# EAGLE design led_board_robot_vs_v2_final (EAGLE 8.0.1)
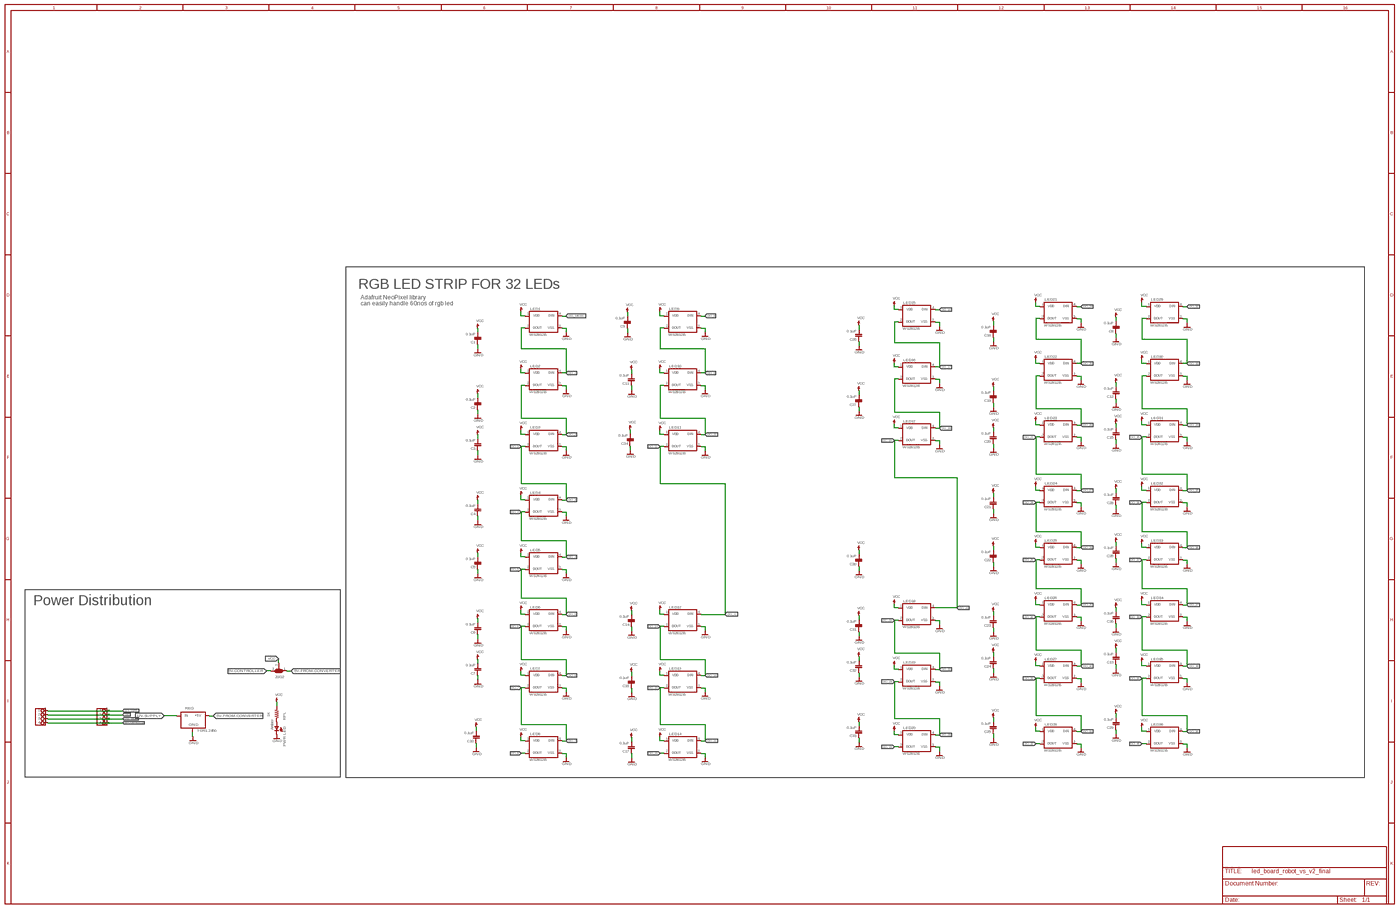
[diagram p0: schematic, sheet 1, overview]
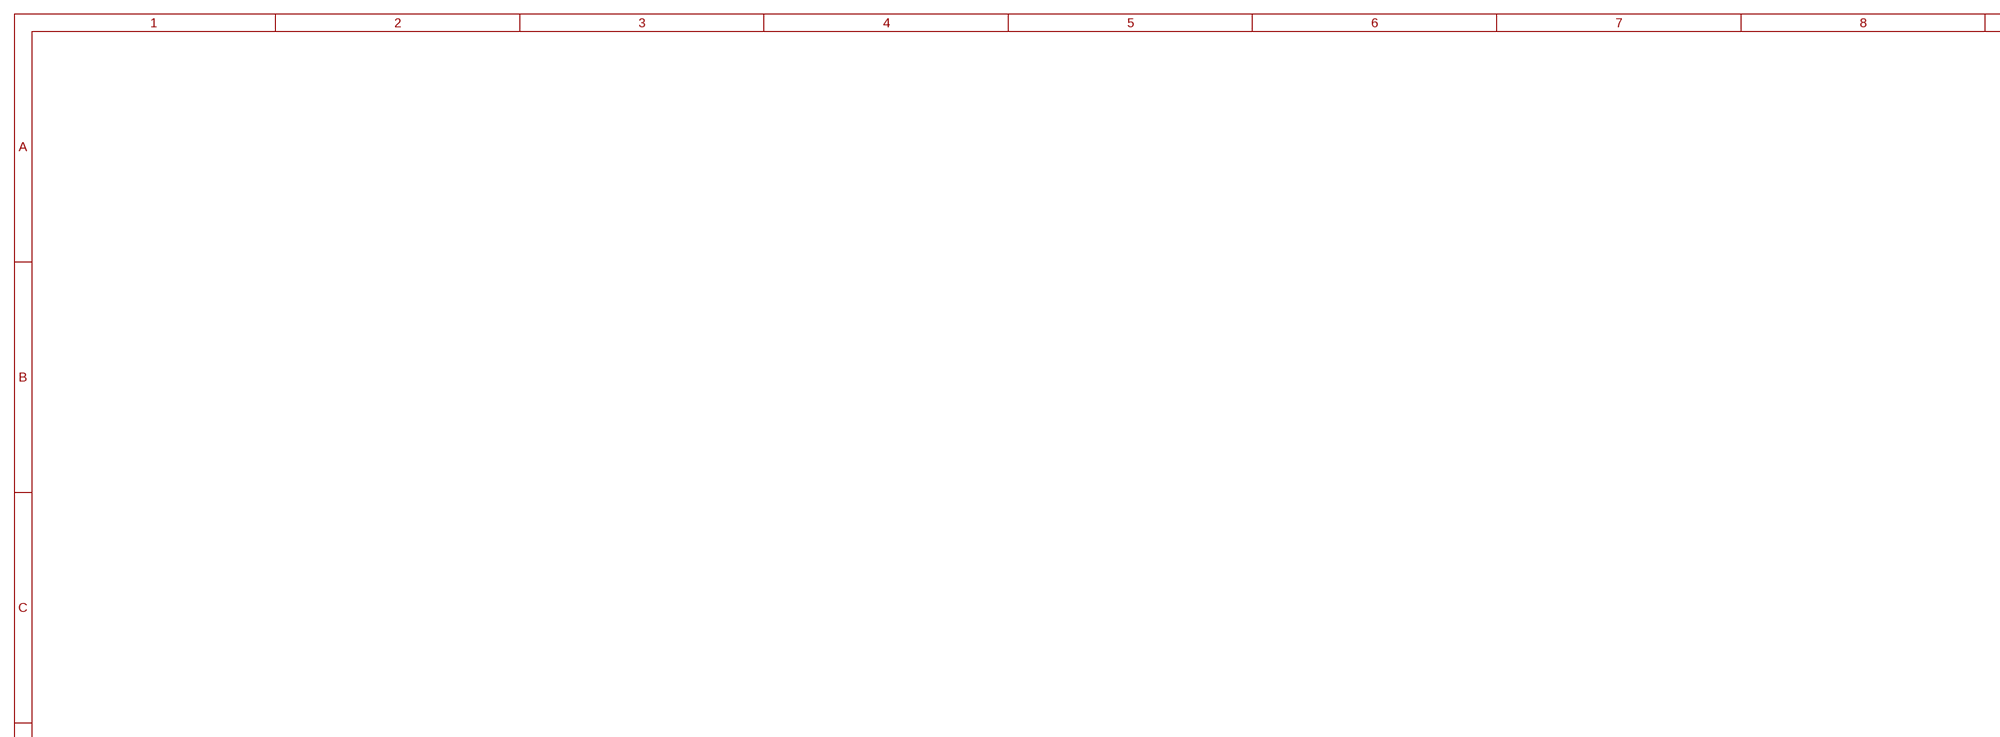
[diagram p1: schematic, sheet 1, part 1 of 4]
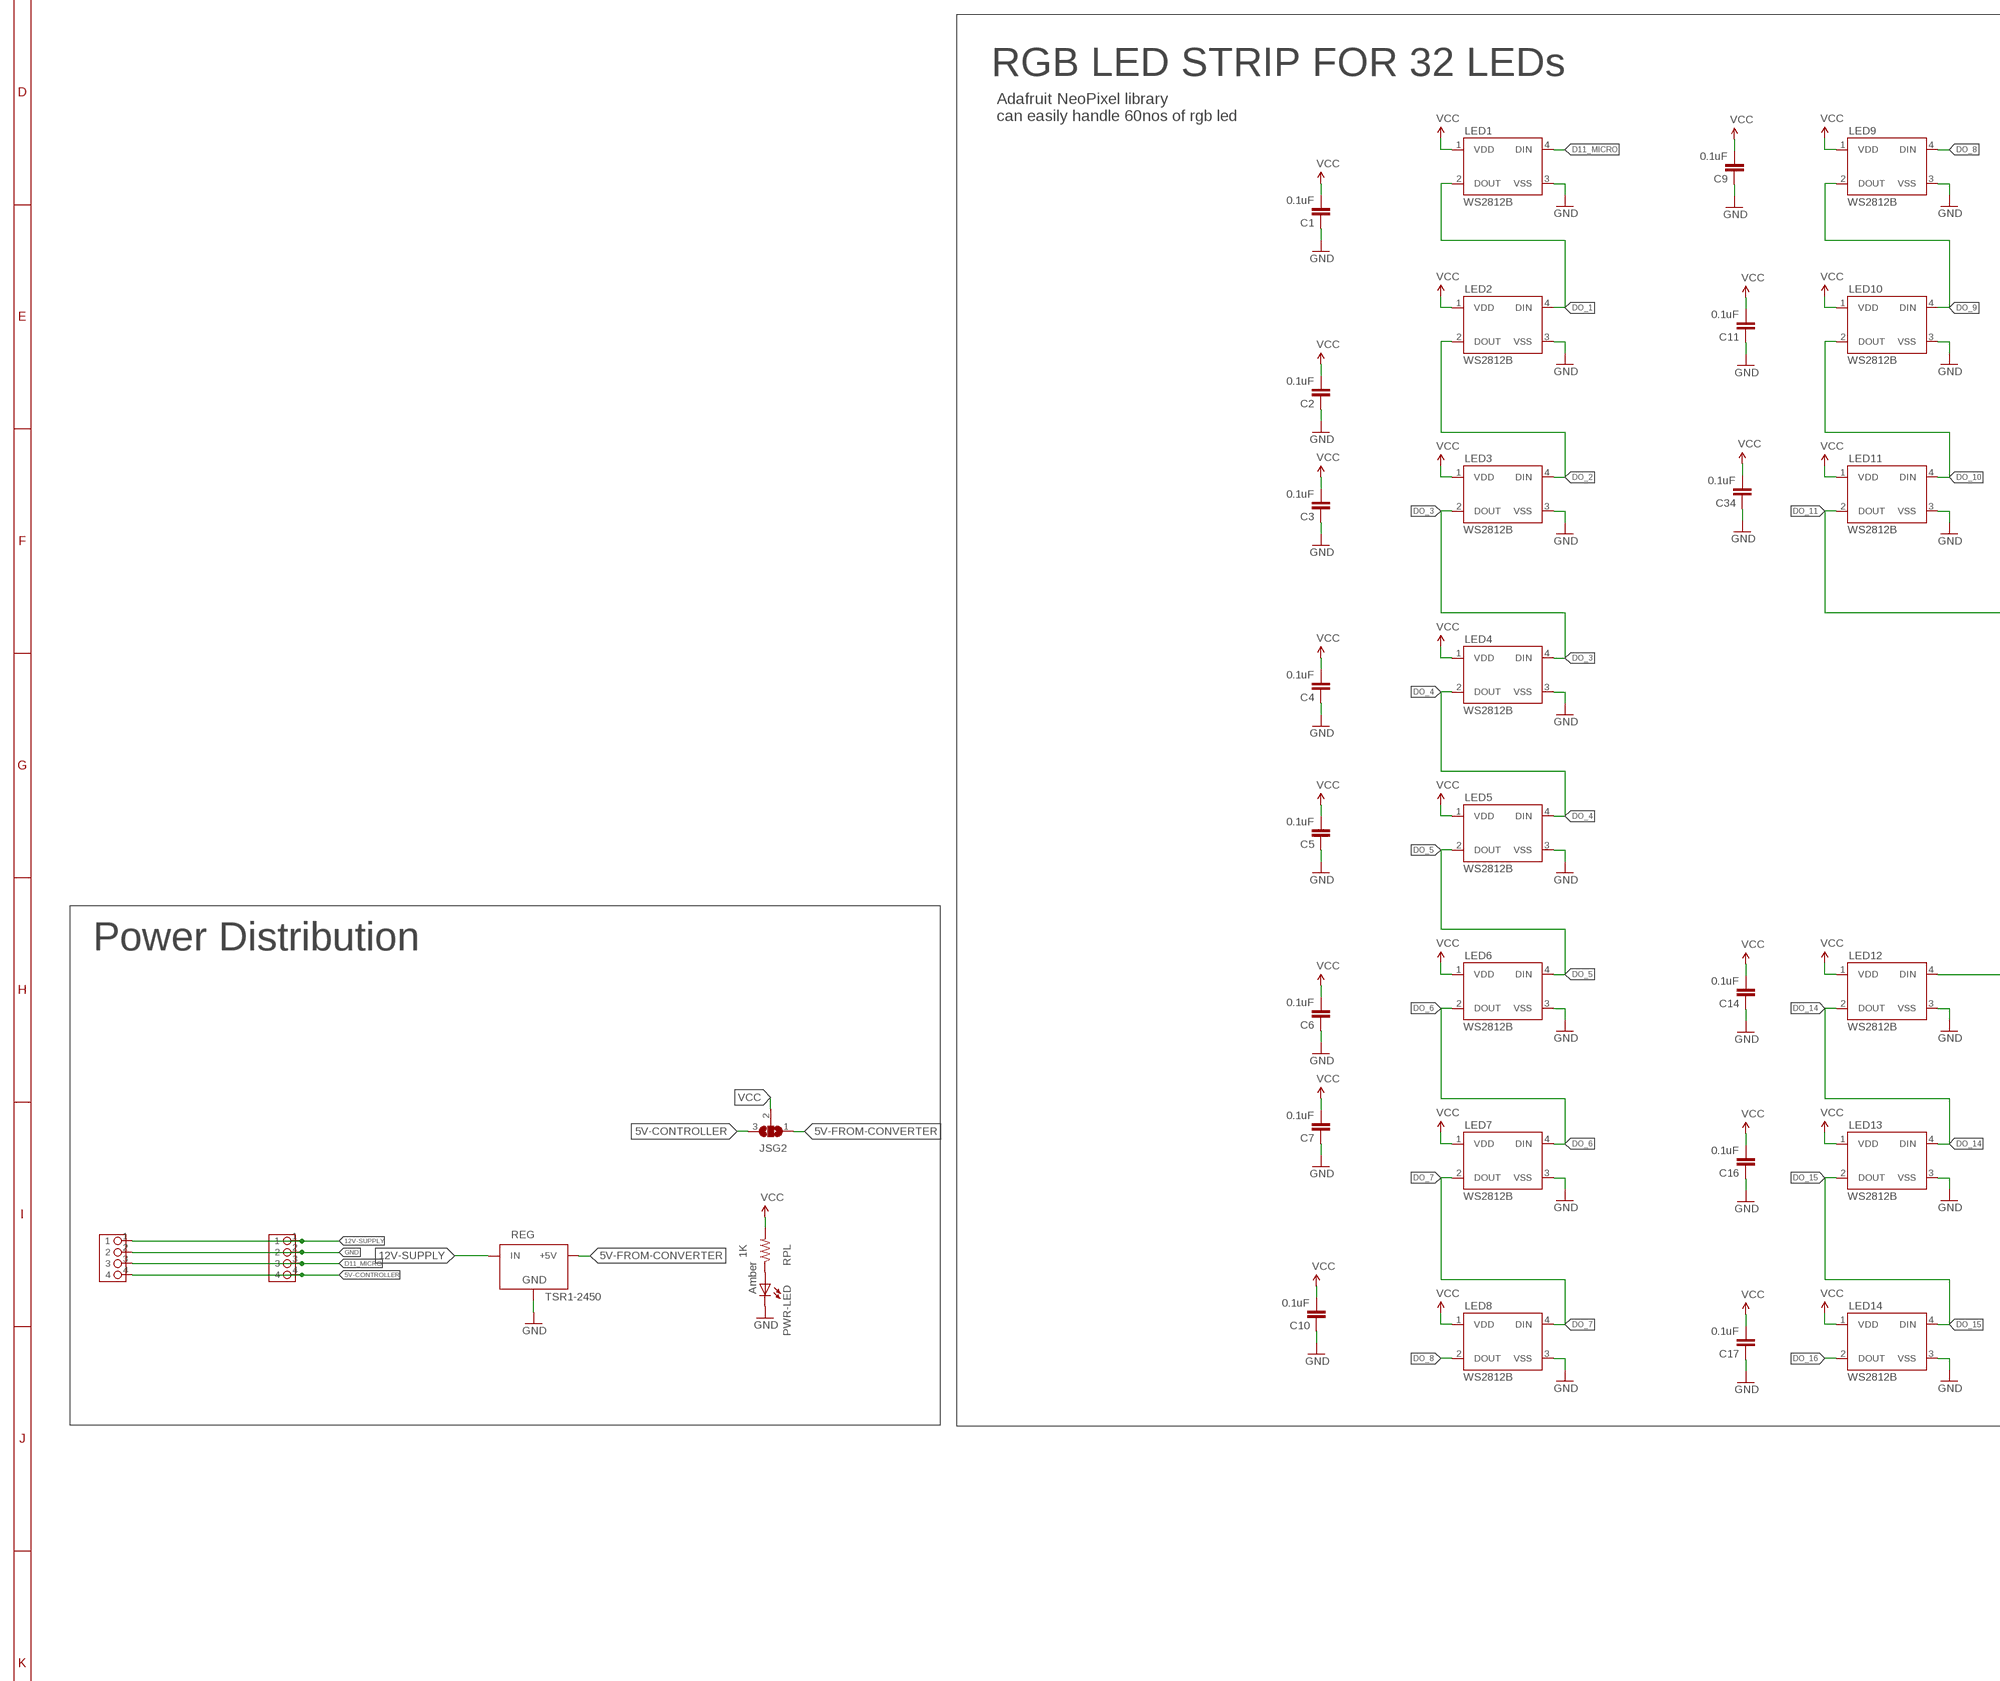
[diagram p2: schematic, sheet 1, part 2 of 4]
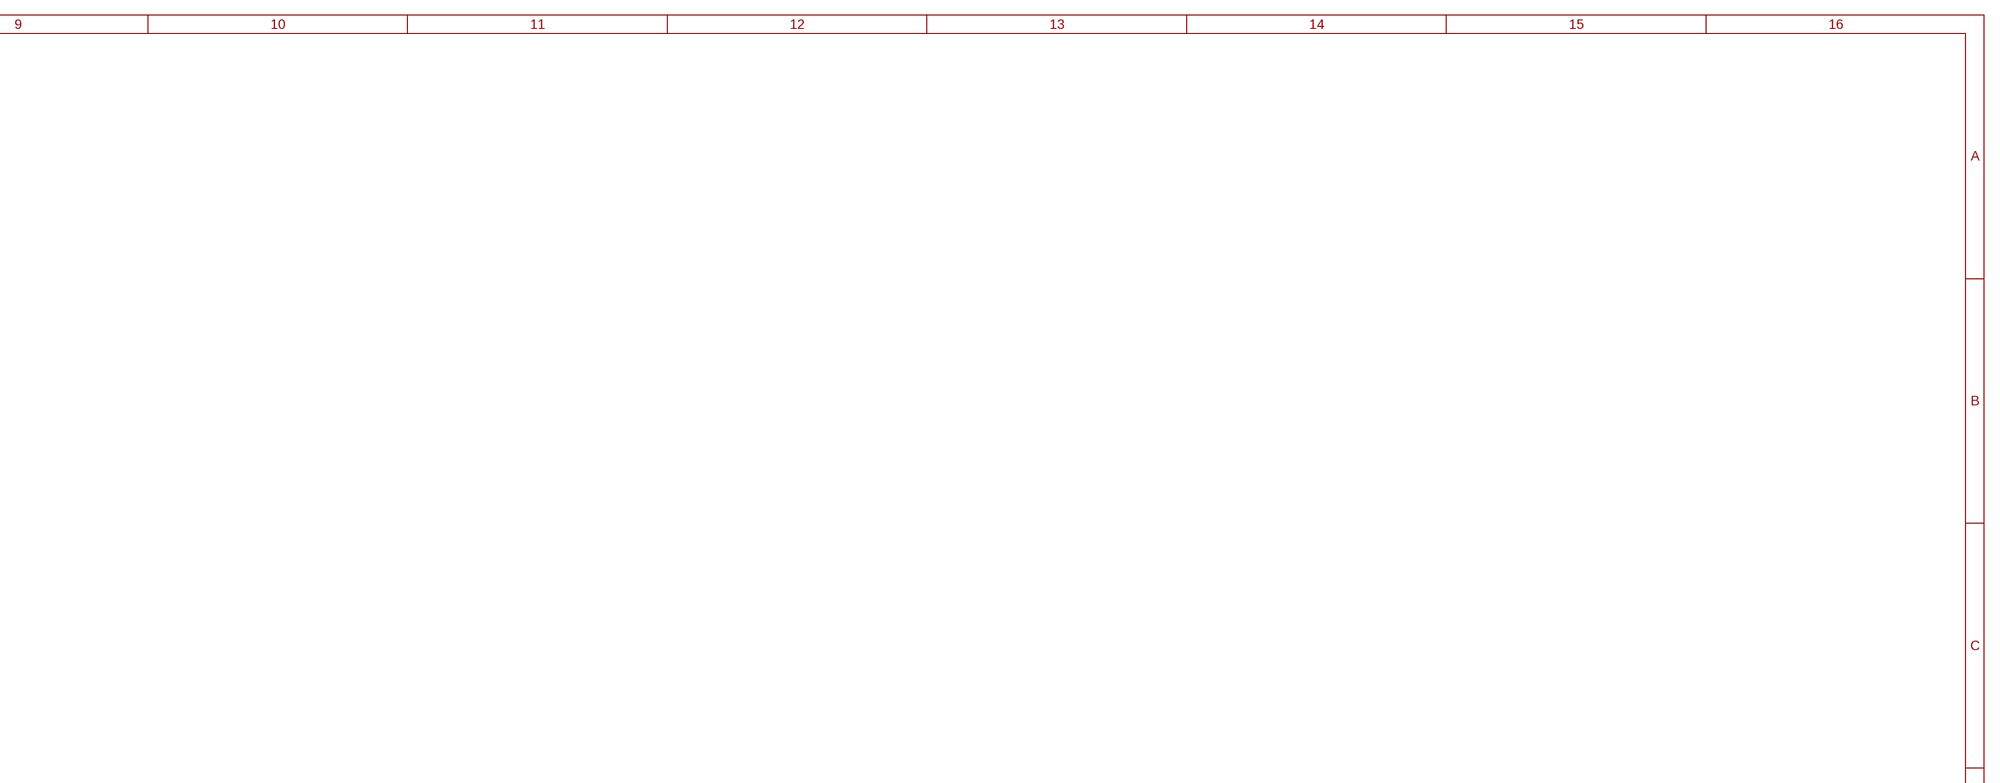
[diagram p3: schematic, sheet 1, part 3 of 4]
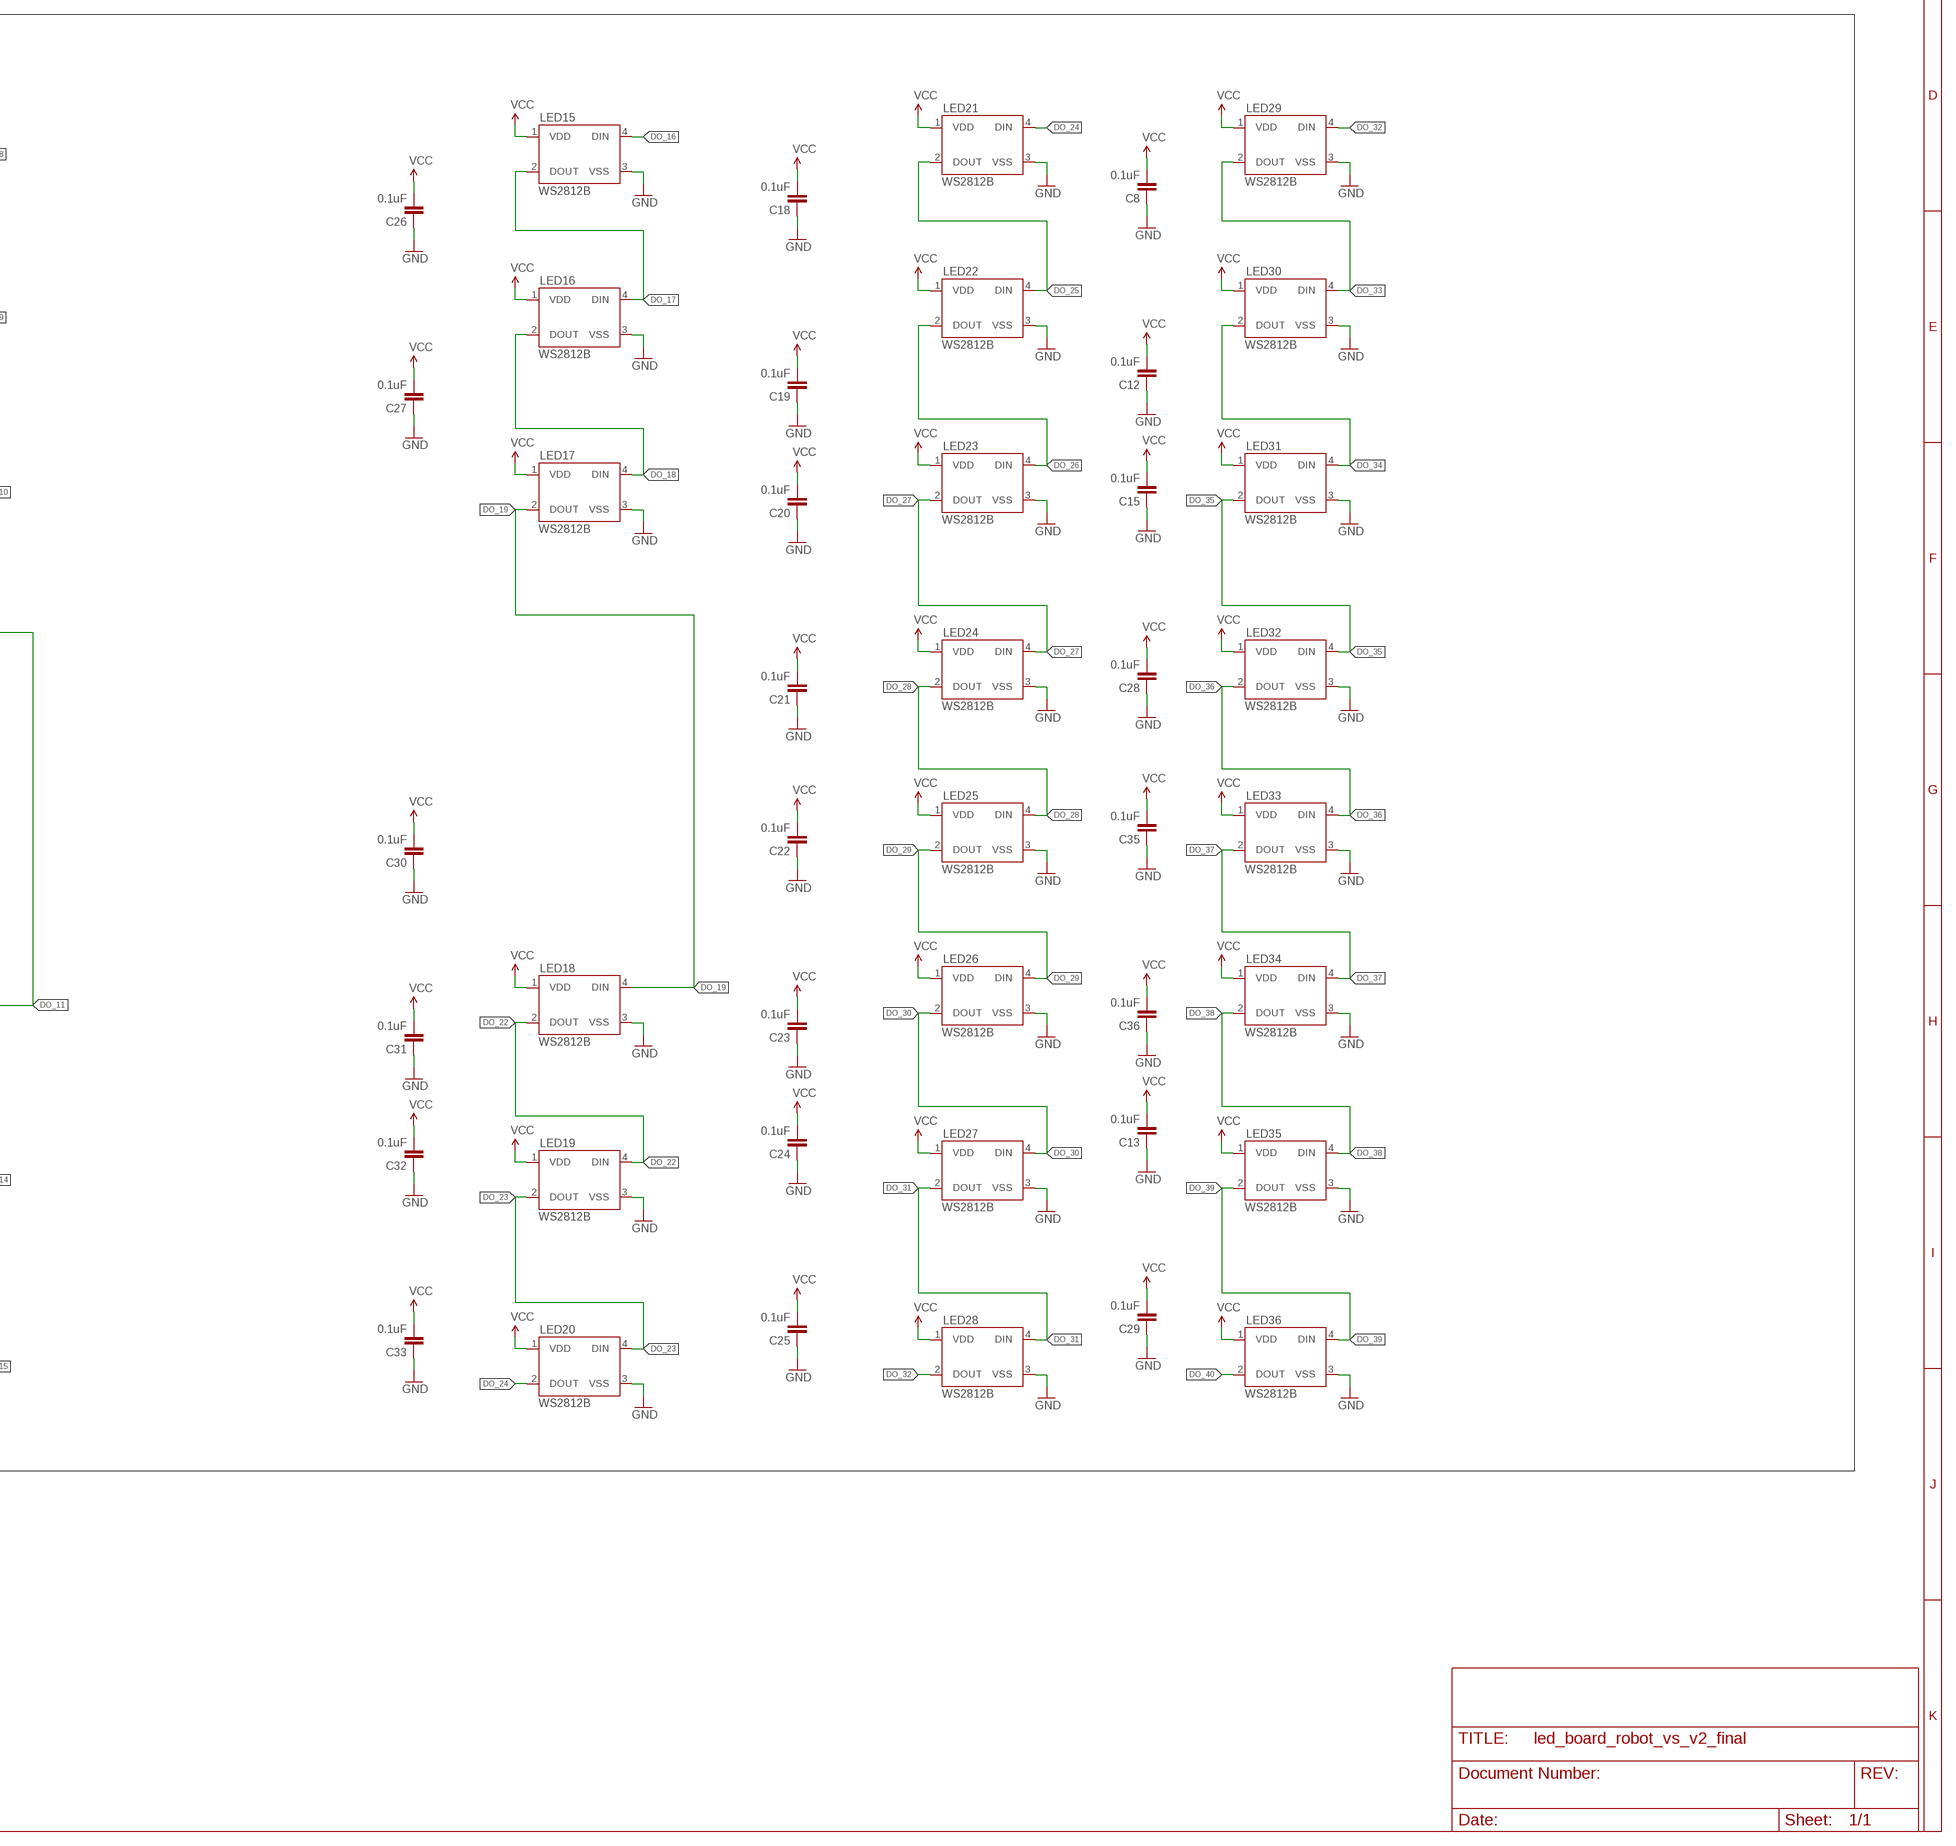
[diagram p4: schematic, sheet 1, part 4 of 4]

## Parts
C1  0.1uF  CAP0603-CAP  [0603-CAP]
C2  0.1uF  CAP0603-CAP  [0603-CAP]
C3  0.1uF  CAP0603-CAP  [0603-CAP]
C4  0.1uF  CAP0603-CAP  [0603-CAP]
C5  0.1uF  CAP0603-CAP  [0603-CAP]
C6  0.1uF  CAP0603-CAP  [0603-CAP]
C7  0.1uF  CAP0603-CAP  [0603-CAP]
C8  0.1uF  CAP0603-CAP  [0603-CAP]
C9  0.1uF  CAP0603-CAP  [0603-CAP]
C10  0.1uF  CAP0603-CAP  [0603-CAP]
C11  0.1uF  CAP0603-CAP  [0603-CAP]
C12  0.1uF  CAP0603-CAP  [0603-CAP]
C13  0.1uF  CAP0603-CAP  [0603-CAP]
C14  0.1uF  CAP0603-CAP  [0603-CAP]
C15  0.1uF  CAP0603-CAP  [0603-CAP]
C16  0.1uF  CAP0603-CAP  [0603-CAP]
C17  0.1uF  CAP0603-CAP  [0603-CAP]
C18  0.1uF  CAP0603-CAP  [0603-CAP]
C19  0.1uF  CAP0603-CAP  [0603-CAP]
C20  0.1uF  CAP0603-CAP  [0603-CAP]
C21  0.1uF  CAP0603-CAP  [0603-CAP]
C22  0.1uF  CAP0603-CAP  [0603-CAP]
C23  0.1uF  CAP0603-CAP  [0603-CAP]
C24  0.1uF  CAP0603-CAP  [0603-CAP]
C25  0.1uF  CAP0603-CAP  [0603-CAP]
C26  0.1uF  CAP0603-CAP  [0603-CAP]
C27  0.1uF  CAP0603-CAP  [0603-CAP]
C28  0.1uF  CAP0603-CAP  [0603-CAP]
C29  0.1uF  CAP0603-CAP  [0603-CAP]
C30  0.1uF  CAP0603-CAP  [0603-CAP]
C31  0.1uF  CAP0603-CAP  [0603-CAP]
C32  0.1uF  CAP0603-CAP  [0603-CAP]
C33  0.1uF  CAP0603-CAP  [0603-CAP]
C34  0.1uF  CAP0603-CAP  [0603-CAP]
C35  0.1uF  CAP0603-CAP  [0603-CAP]
C36  0.1uF  CAP0603-CAP  [0603-CAP]
CON1  MOLEX_LOCKING_4PIN  [MOLEX_LOCKING_4PIN]
CON2  MOLEX_LOCKING_4PIN  [MOLEX_LOCKING_4PIN]
JSG2  SJ2WW  [SJ_2W]
LED1  WS2812B  [WS2812B]
LED2  WS2812B  [WS2812B]
LED3  WS2812B  [WS2812B]
LED4  WS2812B  [WS2812B]
LED5  WS2812B  [WS2812B]
LED6  WS2812B  [WS2812B]
LED7  WS2812B  [WS2812B]
LED8  WS2812B  [WS2812B]
LED9  WS2812B  [WS2812B]
LED10  WS2812B  [WS2812B]
LED11  WS2812B  [WS2812B]
LED12  WS2812B  [WS2812B]
LED13  WS2812B  [WS2812B]
LED14  WS2812B  [WS2812B]
LED15  WS2812B  [WS2812B]
LED16  WS2812B  [WS2812B]
LED17  WS2812B  [WS2812B]
LED18  WS2812B  [WS2812B]
LED19  WS2812B  [WS2812B]
LED20  WS2812B  [WS2812B]
LED21  WS2812B  [WS2812B]
LED22  WS2812B  [WS2812B]
LED23  WS2812B  [WS2812B]
LED24  WS2812B  [WS2812B]
LED25  WS2812B  [WS2812B]
LED26  WS2812B  [WS2812B]
LED27  WS2812B  [WS2812B]
LED28  WS2812B  [WS2812B]
LED29  WS2812B  [WS2812B]
LED30  WS2812B  [WS2812B]
LED31  WS2812B  [WS2812B]
LED32  WS2812B  [WS2812B]
LED33  WS2812B  [WS2812B]
LED34  WS2812B  [WS2812B]
LED35  WS2812B  [WS2812B]
LED36  WS2812B  [WS2812B]
PWR-LED  Amber  LED0603  [LED-0603]
REG  TSR1-2450  [TSR-1]
RPL  1K  RESISTOR0603-RES  [0603-RES]

## Nets
5V-CONTROLLER [power]: CON1.4 CON2.4 JSG2.3
5V-FROM-CONVERTER [power]: JSG2.1 REG.3(+5V)
12V-SUPPLY [power]: CON1.1 CON2.1 REG.1(IN)
D11_MICRO [power]: CON1.3 CON2.3 LED1.4(DIN)
DO_1: LED1.2(DOUT) LED2.4(DIN)
DO_2 [power]: LED2.2(DOUT) LED3.4(DIN)
DO_3 [power]: LED3.2(DOUT) LED4.4(DIN)
DO_4 [power]: LED4.2(DOUT) LED5.4(DIN)
DO_5 [power]: LED5.2(DOUT) LED6.4(DIN)
DO_6 [power]: LED6.2(DOUT) LED7.4(DIN)
DO_7 [power]: LED7.2(DOUT) LED8.4(DIN)
DO_8: LED8.2(DOUT) LED9.4(DIN)
DO_9: LED9.2(DOUT) LED10.4(DIN)
DO_10: LED10.2(DOUT) LED11.4(DIN)
DO_11 [power]: LED11.2(DOUT) LED12.4(DIN)
DO_14 [power]: LED12.2(DOUT) LED13.4(DIN)
DO_15 [power]: LED13.2(DOUT) LED14.4(DIN)
DO_16 [power]: LED14.2(DOUT) LED15.4(DIN)
DO_17 [power]: LED15.2(DOUT) LED16.4(DIN)
DO_18 [power]: LED16.2(DOUT) LED17.4(DIN)
DO_19: LED17.2(DOUT) LED18.4(DIN)
DO_22 [power]: LED18.2(DOUT) LED19.4(DIN)
DO_23 [power]: LED19.2(DOUT) LED20.4(DIN)
DO_24 [power]: LED20.2(DOUT) LED21.4(DIN)
DO_25 [power]: LED21.2(DOUT) LED22.4(DIN)
DO_26 [power]: LED22.2(DOUT) LED23.4(DIN)
DO_27 [power]: LED23.2(DOUT) LED24.4(DIN)
DO_28: LED24.2(DOUT) LED25.4(DIN)
DO_29: LED25.2(DOUT) LED26.4(DIN)
DO_30: LED26.2(DOUT) LED27.4(DIN)
DO_31: LED27.2(DOUT) LED28.4(DIN)
DO_32 [power]: LED28.2(DOUT) LED29.4(DIN)
DO_33 [power]: LED29.2(DOUT) LED30.4(DIN)
DO_34 [power]: LED30.2(DOUT) LED31.4(DIN)
DO_35 [power]: LED31.2(DOUT) LED32.4(DIN)
DO_36: LED32.2(DOUT) LED33.4(DIN)
DO_37: LED33.2(DOUT) LED34.4(DIN)
DO_38: LED34.2(DOUT) LED35.4(DIN)
DO_39: LED35.2(DOUT) LED36.4(DIN)
DO_40 [power]: LED36.2(DOUT)
GND [power]: C1.1 C2.1 C3.1 C4.1 C5.1 C6.1 C7.1 C8.1 C9.1 C10.1 C11.1 C12.1 C13.1 C14.1 C15.1 C16.1 C17.1 C18.1 C19.1 C20.1 C21.1 C22.1 C23.1 C24.1 C25.1 C26.1 C27.1 C28.1 C29.1 C30.1 C31.1 C32.1 C33.1 C34.1 C35.1 C36.1 CON1.2 CON2.2 LED1.3(VSS) LED2.3(VSS) LED3.3(VSS) LED4.3(VSS) LED5.3(VSS) LED6.3(VSS) LED7.3(VSS) LED8.3(VSS) LED9.3(VSS) LED10.3(VSS) LED11.3(VSS) LED12.3(VSS) LED13.3(VSS) LED14.3(VSS) LED15.3(VSS) LED16.3(VSS) LED17.3(VSS) LED18.3(VSS) LED19.3(VSS) LED20.3(VSS) LED21.3(VSS) LED22.3(VSS) LED23.3(VSS) LED24.3(VSS) LED25.3(VSS) LED26.3(VSS) LED27.3(VSS) LED28.3(VSS) LED29.3(VSS) LED30.3(VSS) LED31.3(VSS) LED32.3(VSS) LED33.3(VSS) LED34.3(VSS) LED35.3(VSS) LED36.3(VSS) PWR-LED.C REG.2(GND)
N$17: PWR-LED.A RPL.1
VCC [power]: C1.2 C2.2 C3.2 C4.2 C5.2 C6.2 C7.2 C8.2 C9.2 C10.2 C11.2 C12.2 C13.2 C14.2 C15.2 C16.2 C17.2 C18.2 C19.2 C20.2 C21.2 C22.2 C23.2 C24.2 C25.2 C26.2 C27.2 C28.2 C29.2 C30.2 C31.2 C32.2 C33.2 C34.2 C35.2 C36.2 JSG2.2 LED1.1(VDD) LED2.1(VDD) LED3.1(VDD) LED4.1(VDD) LED5.1(VDD) LED6.1(VDD) LED7.1(VDD) LED8.1(VDD) LED9.1(VDD) LED10.1(VDD) LED11.1(VDD) LED12.1(VDD) LED13.1(VDD) LED14.1(VDD) LED15.1(VDD) LED16.1(VDD) LED17.1(VDD) LED18.1(VDD) LED19.1(VDD) LED20.1(VDD) LED21.1(VDD) LED22.1(VDD) LED23.1(VDD) LED24.1(VDD) LED25.1(VDD) LED26.1(VDD) LED27.1(VDD) LED28.1(VDD) LED29.1(VDD) LED30.1(VDD) LED31.1(VDD) LED32.1(VDD) LED33.1(VDD) LED34.1(VDD) LED35.1(VDD) LED36.1(VDD) RPL.2

## Notes on the sheet
- RGB LED STRIP FOR 32 LEDs
- Adafruit NeoPixel library 
  can easily handle 60nos of rgb led
- Power Distribution

## Library data of the parts
C1-C36 = SparkFun:CAP: Capacitor Standard 0603 ceramic capacitor, and 0.1" leaded capacitor.
CON1 CON2 = molex_connector:MOLEX_LOCKING_4PIN; PARTNO: 43650-0415
JSG2 = jumper:SJ2W: SMD solder JUMPER
LED1-LED36 = SparkFun-LED:WS2812B: WS2812B - Intelligent control LED integrated light source Technical Specifications: Power Supply Voltage (VDD): 3.5 to 5.3 V Input Voltage (VI): -0.5 to VDD+0.5 V Operating Junction Temperature (Topt): -25°C to +80°C Storage Temperature Range (Tstg): -55°C to +150°C; PROD_ID: DIO-12503
PWR-LED = SparkFun:LED: LEDs Standard schematic elements and footprints for 5mm, 3mm, 1206, and 0603 sized LEDs. 5mm - Spark Fun Electronics SKU : COM-00529 (and others)
REG = SteelCaveRobotics-Power:TSR1-2450: Traco Power TSR 1-2450 5.0v switching regulator
RPL = SparkFun:RESISTOR: Resistor Basic schematic elements and footprints for 0603, 1206, and PTH resistors.

## Net classes
0 default: width 0.762 mm, drill 0.762 mm, clearance 0.559 mm
1 power: width 0.762 mm, drill 0.762 mm, clearance 0.381 mm
2 Massa: width 0.8 mm, drill 0.6 mm, clearance 0.2 mm
3 Mot: width 1.2 mm, drill 0.8 mm, clearance 0.005 mm
4 motor: width 0.305 mm, drill 0.406 mm, clearance 0.203 mm

## Board
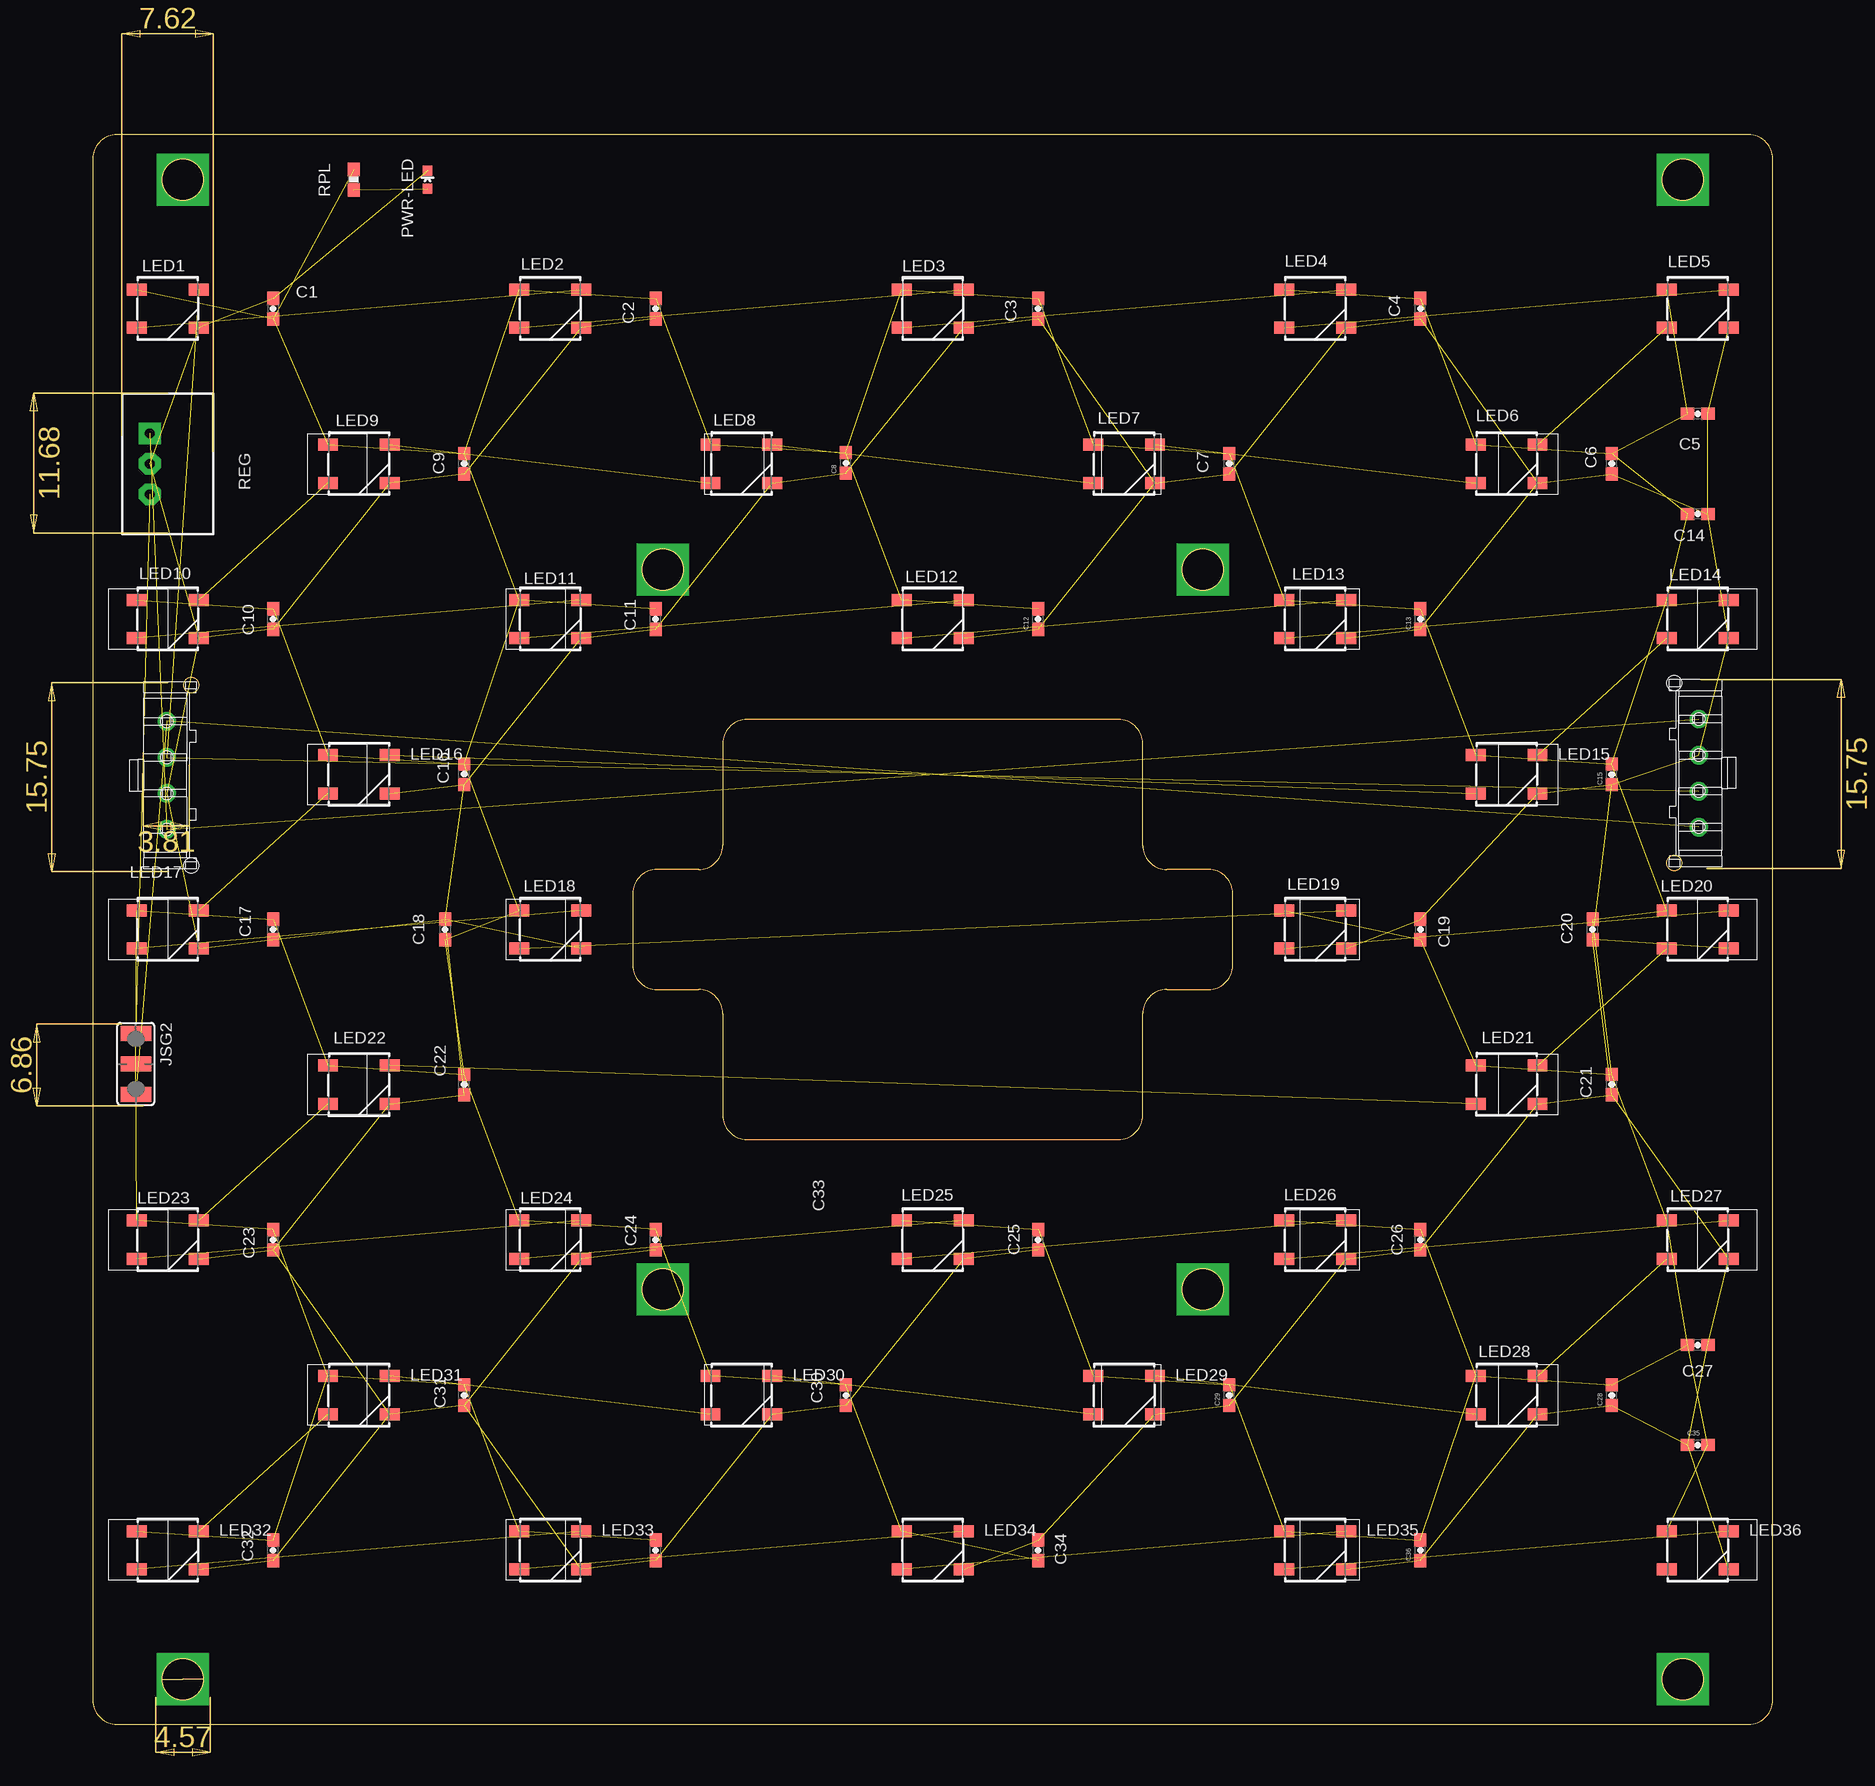
[diagram p5: board, top side]

Size 140 x 132.5 mm. Coordinates in mm from the lower left corner, seen from the top.
Outline: 2,0 138,0 arc90 140,2 140,130.5 arc90 138,132.5 2,132.5 arc90 0,130.5 0,2 arc90 2,0
Outline: 52.5,59.25 52.5,50.75 arc90 54.5,48.75 85.5,48.75 arc90 87.5,50.75 87.5,59.25 arc-90 89.5,61.25 93,61.25 arc90 95,63.25 95,69.25 arc90 93,71.25 89.5,71.25 arc-90 87.5,73.25 87.5,81.75 arc90 85.5,83.75 54.5,83.75 arc90 52.5,81.75 52.5,73.25 arc-90 50.5,71.25 47,71.25 arc90 45,69.25 45,63.25 arc90 47,61.25 50.5,61.25 arc-90 52.5,59.25
Outline: circle at 132.5,128.75 radius 1.7
Outline: circle at 7.5,3.75 radius 1.7
Outline: circle at 7.5,128.75 radius 1.7
Outline: circle at 132.5,3.75 radius 1.7
Outline: circle at 47.5,96.25 radius 1.7
Outline: circle at 47.5,36.25 radius 1.7
Outline: circle at 92.5,96.25 radius 1.7
Outline: circle at 92.5,36.25 radius 1.7
Outline: circle at 47.5,96.25 radius 1.7
Outline: circle at 92.5,36.25 radius 1.7
Outline: circle at 92.5,96.25 radius 1.7
Outline: circle at 47.5,36.25 radius 1.7
Copper layers (1*16): Top 0.035mm / dielectric 1.5mm / Bottom 0.035mm
Design rules "default": minimum track width 10mil, minimum drill 24mil, track to track 8mil, track to pad 8mil, pad to pad 8mil, via to via 8mil, smd to smd 8mil, copper to edge 40mil, drill to drill 8mil, minimum pad ring 10mil, minimum via ring 8mil, stop-mask expansion 4mil, vias tented up to drill 0mil, thermal gap 10mil

### Footprints (pad centres in the part's own frame; a part is rotated, then mirrored left to right if it is on the bottom)
0603-CAP = smd 1.1 x 1: 1 -0.85,0; 2 0.85,0
MOLEX_LOCKING_4PIN = drill 1.02: 1 -4.593,0.08; 2 -1.591,0.08; 3 1.41,0.08; 4 4.412,0.08
SJ_2W = smd 1.27 x 2.54: 1 -2.54,0; 2 0,0; 3 2.54,0
WS2812B = smd 1.651 x 1: 1 -2.577,1.6; 2 -2.577,-1.6; 3 2.577,-1.6; 4 2.577,1.6
LED-0603 = smd 0.8 x 0.8: A 0,-0.75; C 0,0.75
TSR-1 = drill 0.8 pad 1.8 square: 1 -2.54,-1.5 | drill 0.8 pad 1.8 octagon: 2 0,-1.5; 3 2.54,-1.5
0603-RES = smd 1.1 x 1: 1 -0.85,0; 2 0.85,0

### Placement (x,y rotation side)
C1  15.02,118 270 top
C2  46.9,118 90 top
C3  78.77,118 90 top
C4  110.64,118 90 top
C5  133.75,109.23 180 top
C6  126.59,105.07 90 top
C7  94.71,105.07 90 top
C8  62.76,105.14 90 top
C9  30.95,105.07 90 top
C10  15.02,92.12 90 top
C11  46.9,92.12 90 top
C12  78.77,92.12 90 top
C13  110.64,92.12 90 top
C14  133.75,100.89 180 top
C15  126.59,79.18 90 top
C16  30.95,79.19 90 top
C17  15.02,66.25 90 top
C18  29.35,66.25 270 top
C19  110.64,66.25 270 top
C20  124.98,66.25 90 top
C21  126.59,53.32 90 top
C22  30.95,53.32 90 top
C23  15.02,40.38 90 top
C24  46.9,40.38 90 top
C25  78.77,40.38 90 top
C26  110.64,40.38 90 top
C27  133.75,31.61 180 top
C28  126.59,27.43 90 top
C29  94.71,27.43 90 top
C30  62.76,27.43 90 top
C31  30.95,27.43 90 top
C32  15.02,14.5 90 top
C33  46.9,14.5 90 top
C34  78.77,14.5 270 top
C35  133.75,23.27 0 top
C36  110.64,14.5 90 top
CON1  133.75,79.19 270 top
CON2  6.25,79.19 90 top
JSG2  3.58,55.04 270 top
LED1  6.25,118 0 top
LED2  38.12,118 0 top
LED3  70,118 0 top
LED4  101.88,118 0 top
LED5  133.75,118 0 top
LED6  117.82,105.07 0 top
LED7  85.94,105.07 0 top
LED8  54.06,105.07 0 top
LED9  22.18,105.07 0 top
LED10  6.25,92.12 0 top
LED11  38.12,92.12 0 top
LED12  70,92.12 0 top
LED13  101.88,92.12 0 top
LED14  133.75,92.12 0 top
LED15  117.82,79.18 0 top
LED16  22.18,79.19 0 top
LED17  6.25,66.25 0 top
LED18  38.12,66.25 0 top
LED19  101.88,66.25 0 top
LED20  133.75,66.25 0 top
LED21  117.82,53.32 0 top
LED22  22.18,53.31 0 top
LED23  6.25,40.38 0 top
LED24  38.12,40.38 0 top
LED25  70,40.38 0 top
LED26  101.88,40.38 0 top
LED27  133.75,40.38 0 top
LED28  117.82,27.43 0 top
LED29  85.94,27.43 0 top
LED30  54.06,27.43 0 top
LED31  22.18,27.43 0 top
LED32  6.25,14.5 0 top
LED33  38.12,14.5 0 top
LED34  70,14.5 0 top
LED35  101.88,14.5 0 top
LED36  133.75,14.5 0 top
PWR-LED  27.9,128.75 0 top
REG  6.25,105.07 270 top
RPL  21.75,128.75 90 top

### Tracks (layer width: path | path; a pad name or v marks a point on that pad's centre or on a via)
5V-CONTROLLER  (2 unrouted)
5V-FROM-CONVERTER  (1 unrouted)
12V-SUPPLY  (2 unrouted)
D11_MICRO  (2 unrouted)
DO_1  (1 unrouted)
DO_2  (1 unrouted)
DO_3  (1 unrouted)
DO_4  (1 unrouted)
DO_5  (1 unrouted)
DO_6  (1 unrouted)
DO_7  (1 unrouted)
DO_8  (1 unrouted)
DO_9  (1 unrouted)
DO_10  (1 unrouted)
DO_11  (1 unrouted)
DO_14  (1 unrouted)
DO_15  (1 unrouted)
DO_16  (1 unrouted)
DO_17  (1 unrouted)
DO_18  (1 unrouted)
DO_19  (1 unrouted)
DO_22  (1 unrouted)
DO_23  (1 unrouted)
DO_24  (1 unrouted)
DO_25  (1 unrouted)
DO_26  (1 unrouted)
DO_27  (1 unrouted)
DO_28  (1 unrouted)
DO_29  (1 unrouted)
DO_30  (1 unrouted)
DO_31  (1 unrouted)
DO_32  (1 unrouted)
DO_33  (1 unrouted)
DO_34  (1 unrouted)
DO_35  (1 unrouted)
DO_36  (1 unrouted)
DO_37  (1 unrouted)
DO_38  (1 unrouted)
DO_39  (1 unrouted)
GND  (75 unrouted)
N$1  (via drill 3.3 pad 3.4)
  other vias: 7.5,128.75
N$2  (via drill 3.3)
  other vias: 7.5,3.75
N$3  (via drill 3.3)
  other vias: 132.5,3.75
N$4  (via drill 3.3)
  other vias: 132.5,128.75
N$5  (via drill 3.3 pad 3.4)
  other vias: 47.5,96.25
N$6  (via drill 3.3 pad 3.4)
  other vias: 92.5,36.25
N$7  (via drill 3.3 pad 3.4)
  other vias: 92.5,96.25
N$8  (via drill 3.3 pad 3.4)
  other vias: 47.5,36.25
N$17  (1 unrouted)
VCC  (73 unrouted)

### Text on the board
Document: LED_BOARD_ROBOT_VS_V2 | LED_BOARD_ROBOT_VS_V2